# Altium schematic sheet Board CD.SchDoc
size A3
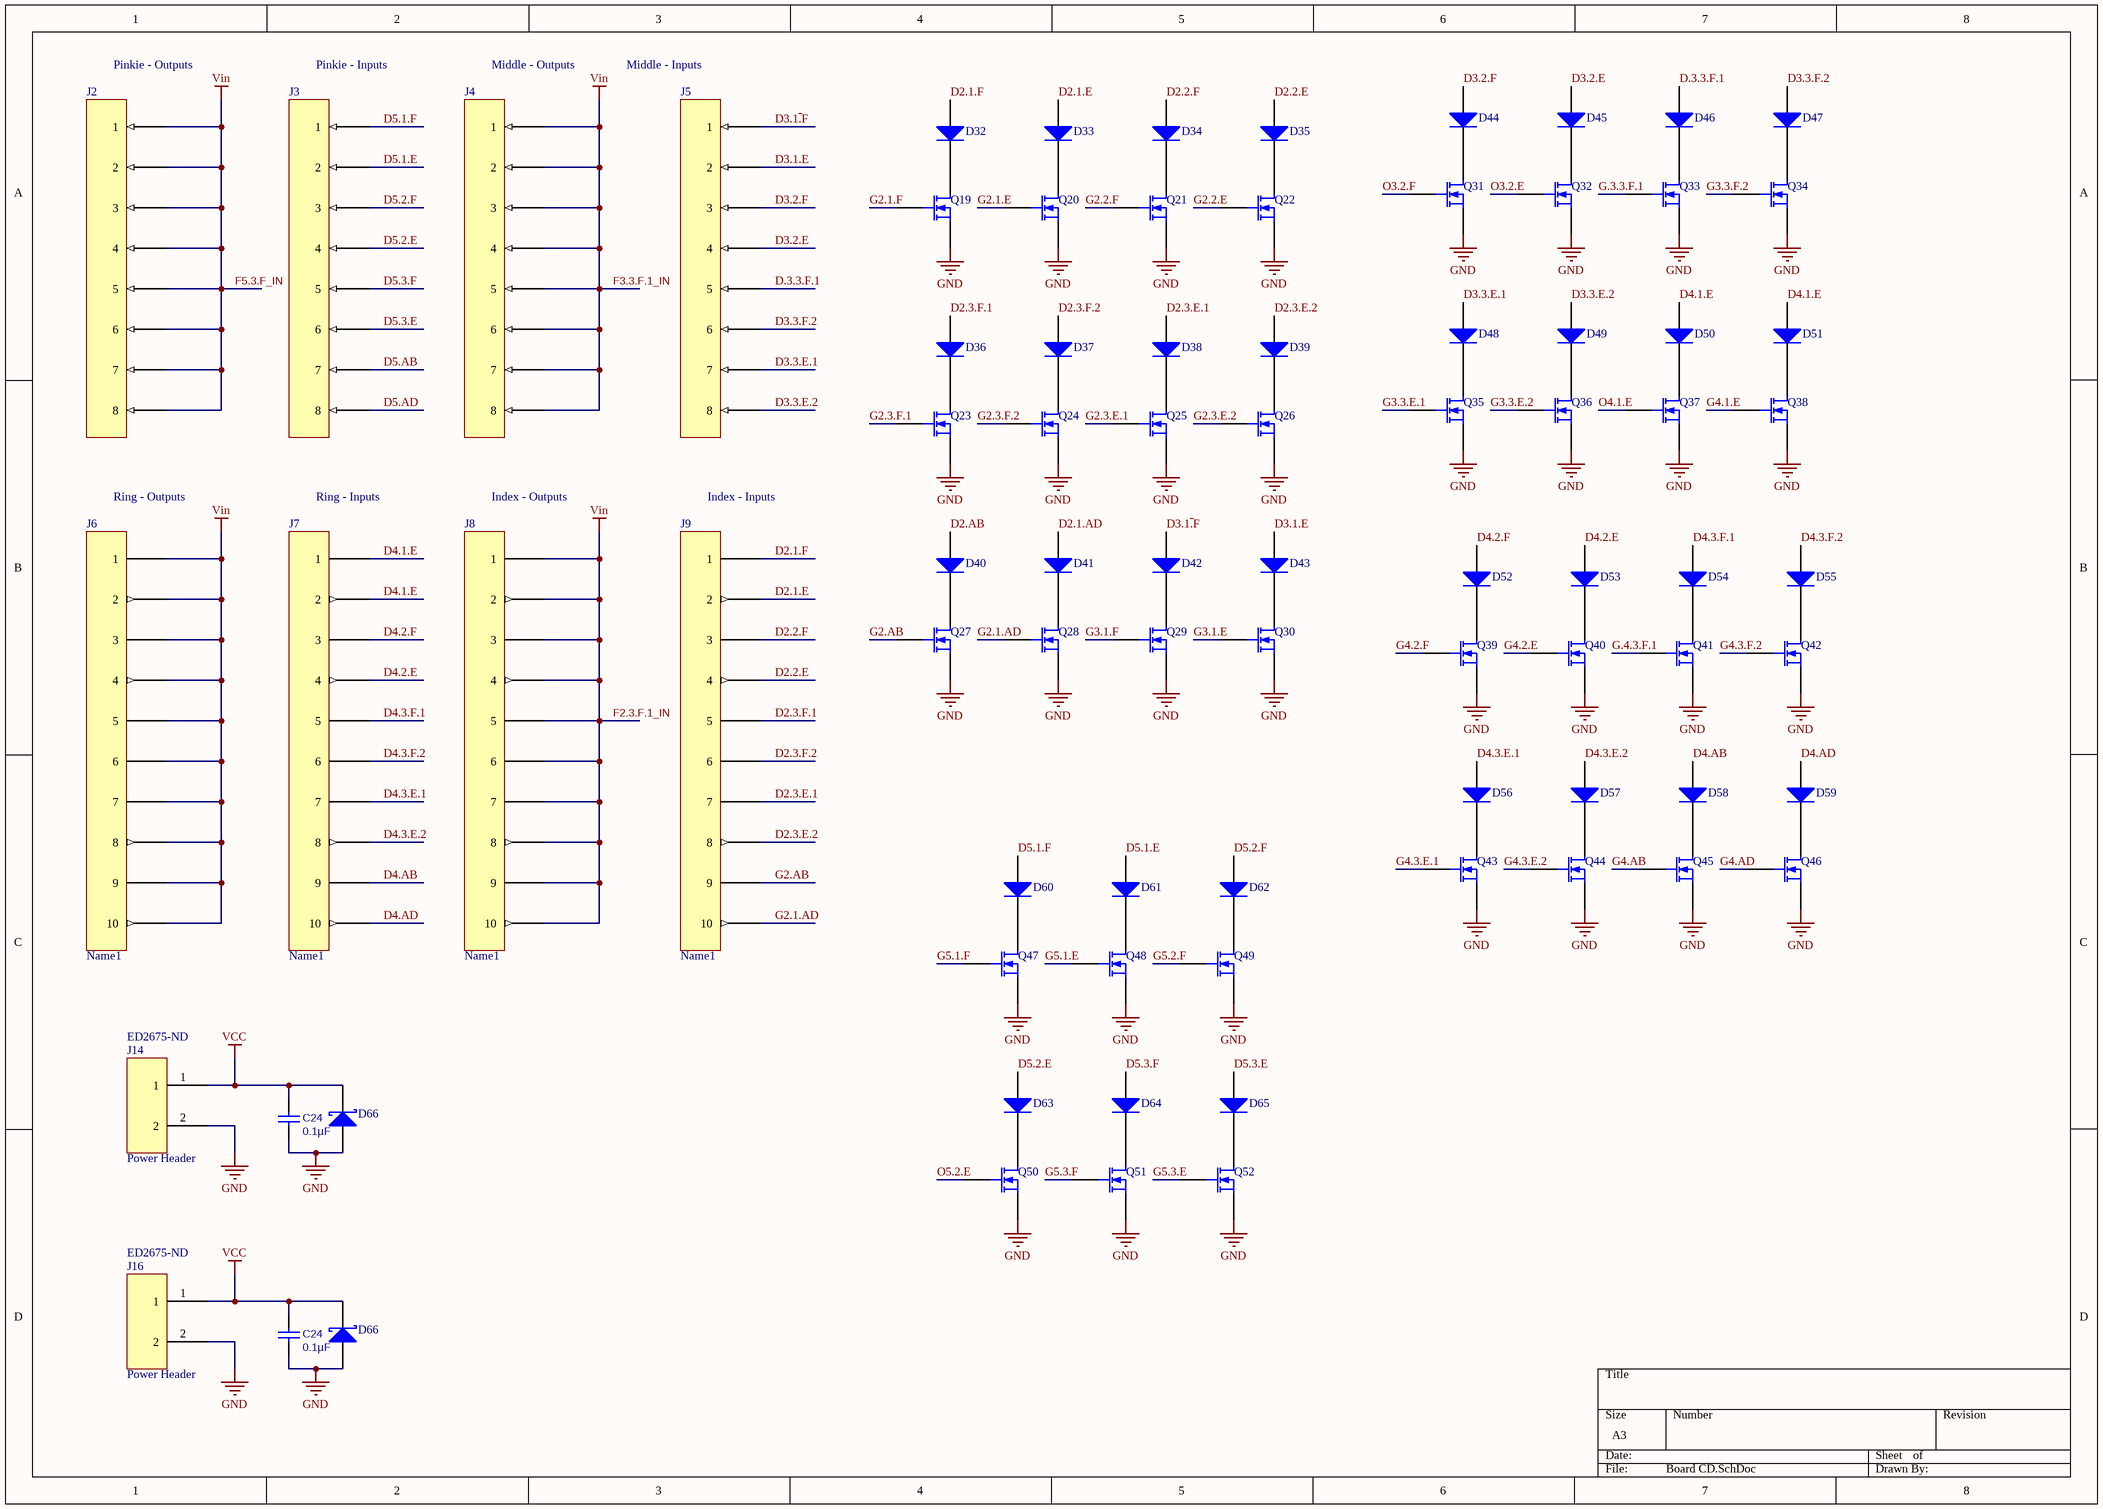
[diagram p0: Board CD.SchDoc]

## Parts
(Parts that share a designator on the sheet are numbered #1, #2 ... from top to bottom, then left to right.)
C24#1  value 0.1µF  [TDK C-Series (1608)]
C24#2  value 0.1µF  [TDK C-Series (1608)]
D32  de  [SMC]  (value not drawn)
D33  de  [SMC]  (value not drawn)
D34  de  [SMC]  (value not drawn)
D35  de  [SMC]  (value not drawn)
D36  de  [SMC]  (value not drawn)
D37  de  [SMC]  (value not drawn)
D38  de  [SMC]  (value not drawn)
D39  de  [SMC]  (value not drawn)
D40  de  [SMC]  (value not drawn)
D41  de  [SMC]  (value not drawn)
D42  de  [SMC]  (value not drawn)
D43  de  [SMC]  (value not drawn)
D44  de  [SMC]  (value not drawn)
D45  de  [SMC]  (value not drawn)
D46  de  [SMC]  (value not drawn)
D47  de  [SMC]  (value not drawn)
D48  de  [SMC]  (value not drawn)
D49  de  [SMC]  (value not drawn)
D50  de  [SMC]  (value not drawn)
D51  de  [SMC]  (value not drawn)
D52  de  [SMC]  (value not drawn)
D53  de  [SMC]  (value not drawn)
D54  de  [SMC]  (value not drawn)
D55  de  [SMC]  (value not drawn)
D56  de  [SMC]  (value not drawn)
D57  de  [SMC]  (value not drawn)
D58  de  [SMC]  (value not drawn)
D59  de  [SMC]  (value not drawn)
D60  de  [SMC]  (value not drawn)
D61  de  [SMC]  (value not drawn)
D62  de  [SMC]  (value not drawn)
D63  de  [SMC]  (value not drawn)
D64  de  [SMC]  (value not drawn)
D65  de  [SMC]  (value not drawn)
D66#1  Diode BAT17  [SOT-23_N]  (value not drawn)
D66#2  Diode BAT17  [SOT-23_N]  (value not drawn)
J2  3-794630-8  (value not drawn)
J3  3-794630-8  (value not drawn)
J4  3-794630-8  (value not drawn)
J5  3-794630-8  (value not drawn)
J6  Name1
J7  Name1
J8  Name1
J9  Name1
J14  Power Header  Supplier Part Number 1: ED2675-ND
J16  Power Header  Supplier Part Number 1: ED2675-ND
Q19  (no value)
Q20  (no value)
Q21  (no value)
Q22  (no value)
Q23  (no value)
Q24  (no value)
Q25  (no value)
Q26  (no value)
Q27  (no value)
Q28  (no value)
Q29  (no value)
Q30  (no value)
Q31  (no value)
Q32  (no value)
Q33  (no value)
Q34  (no value)
Q35  (no value)
Q36  (no value)
Q37  (no value)
Q38  (no value)
Q39  (no value)
Q40  (no value)
Q41  (no value)
Q42  (no value)
Q43  (no value)
Q44  (no value)
Q45  (no value)
Q46  (no value)
Q47  (no value)
Q48  (no value)
Q49  (no value)
Q50  (no value)
Q51  (no value)
Q52  (no value)

## Nets
F2.3.F.1_IN: J2.1 J2.3 J2.4 J2.5 J2.6 J2.7 J2.8 J2.66(2) J4.1 J4.3 J4.4 J4.5 J4.6 J4.7 J4.8 J4.66(2) J6.1 J6.3 J6.4 J6.5 J6.6 J6.7 J6.8 J6.9 J6.10 J6.66(2) J8.1 J8.3 J8.4 J8.5 J8.6 J8.7 J8.8 J8.9 J8.10 J8.66(2)  [also labelled F3.3.F.1_IN, F5.3.F_IN, Vin]
GND: C24#1.1 C24#2.1 D66#1.1(A) D66#2.1(A) J14.2 J16.2 Q19.3(S) Q20.3(S) Q21.3(S) Q22.3(S) Q23.3(S) Q24.3(S) Q25.3(S) Q26.3(S) Q27.3(S) Q28.3(S) Q29.3(S) Q30.3(S) Q31.3(S) Q32.3(S) Q33.3(S) Q34.3(S) Q35.3(S) Q36.3(S) Q37.3(S) Q38.3(S) Q39.3(S) Q40.3(S) Q41.3(S) Q42.3(S) Q43.3(S) Q44.3(S) Q45.3(S) Q46.3(S) Q47.3(S) Q48.3(S) Q49.3(S) Q50.3(S) Q51.3(S) Q52.3(S)
VCC: C24#1.2 C24#2.2 D66#1.3(K) D66#2.3(K) J14.1 J16.1
D2.1.AD: D41.1(A)
D2.1.E: D33.1(A) J9.66(2)
D2.1.F: D32.1(A) J9.1
D2.2.E: D35.1(A) J9.4
D2.2.F: D34.1(A) J9.3
D2.3.E.1: D38.1(A) J9.7
D2.3.E.2: D39.1(A) J9.8
D2.3.F.1: D36.1(A) J9.5
D2.3.F.2: D37.1(A) J9.6
D2.AB: D40.1(A)
D3.1~{.}F: D42.1(A) J5.1
D3.1.E: D43.1(A) J5.66(2)
D3.2.E: D45.1(A) J5.4
D3.2.F: D44.1(A) J5.3
D3.3.E.1: D48.1(A) J5.7
D3.3.E.2: D49.1(A) J5.8
D3.3.F.2: D47.1(A) J5.6
D4.1.E: D50.1(A) D51.1(A) J7.1 J7.66(2)
D4.2.E: D53.1(A) J7.4
D4.2.F: D52.1(A) J7.3
D4.3.E.1: D56.1(A) J7.7
D4.3.E.2: D57.1(A) J7.8
D4.3.F.1: D54.1(A) J7.5
D4.3.F.2: D55.1(A) J7.6
D4.AB: D58.1(A) J7.9
D4.AD: D59.1(A) J7.10
D5.1.E: D61.1(A) J3.66(2)
D5.1.F: D60.1(A) J3.1
D5.2.E: D63.1(A) J3.4
D5.2.F: D62.1(A) J3.3
D5.3.E: D65.1(A) J3.6
D5.3.F: D64.1(A) J3.5
D5.AB: J3.7
D5.AD: J3.8
D.3.3.F.1: D46.1(A) J5.5
G2.1.AD: J9.10 Q28.2(G)
G2.1.E: Q20.2(G)
G2.1.F: Q19.2(G)
G2.2.E: Q22.2(G)
G2.2.F: Q21.2(G)
G2.3.E.1: Q25.2(G)
G2.3.E.2: Q26.2(G)
G2.3.F.1: Q23.2(G)
G2.3.F.2: Q24.2(G)
G2.AB: J9.9 Q27.2(G)
G3.1.E: Q30.2(G)
G3.1.F: Q29.2(G)
G3.3.E.1: Q35.2(G)
G3.3.E.2: Q36.2(G)
G3.3.F.2: Q34.2(G)
G4.1.E: Q38.2(G)
G4.2.E: Q40.2(G)
G4.2.F: Q39.2(G)
G4.3.E.1: Q43.2(G)
G4.3.E.2: Q44.2(G)
G4.3.F.2: Q42.2(G)
G4.AB: Q45.2(G)
G4.AD: Q46.2(G)
G5.1.E: Q48.2(G)
G5.1.F: Q47.2(G)
G5.2.F: Q49.2(G)
G5.3.E: Q52.2(G)
G5.3.F: Q51.2(G)
G.3.3.F.1: Q33.2(G)
G.4.3.F.1: Q41.2(G)
O3.2.E: Q32.2(G)
O3.2.F: Q31.2(G)
O4.1.E: Q37.2(G)
O5.2.E: Q50.2(G)
NetD32_2: D32.2(K) Q19.1(D)
NetD33_2: D33.2(K) Q20.1(D)
NetD34_2: D34.2(K) Q21.1(D)
NetD35_2: D35.2(K) Q22.1(D)
NetD36_2: D36.2(K) Q23.1(D)
NetD37_2: D37.2(K) Q24.1(D)
NetD38_2: D38.2(K) Q25.1(D)
NetD39_2: D39.2(K) Q26.1(D)
NetD40_2: D40.2(K) Q27.1(D)
NetD41_2: D41.2(K) Q28.1(D)
NetD42_2: D42.2(K) Q29.1(D)
NetD43_2: D43.2(K) Q30.1(D)
NetD44_2: D44.2(K) Q31.1(D)
NetD45_2: D45.2(K) Q32.1(D)
NetD46_2: D46.2(K) Q33.1(D)
NetD47_2: D47.2(K) Q34.1(D)
NetD48_2: D48.2(K) Q35.1(D)
NetD49_2: D49.2(K) Q36.1(D)
NetD50_2: D50.2(K) Q37.1(D)
NetD51_2: D51.2(K) Q38.1(D)
NetD52_2: D52.2(K) Q39.1(D)
NetD53_2: D53.2(K) Q40.1(D)
NetD54_2: D54.2(K) Q41.1(D)
NetD55_2: D55.2(K) Q42.1(D)
NetD56_2: D56.2(K) Q43.1(D)
NetD57_2: D57.2(K) Q44.1(D)
NetD58_2: D58.2(K) Q45.1(D)
NetD59_2: D59.2(K) Q46.1(D)
NetD60_2: D60.2(K) Q47.1(D)
NetD61_2: D61.2(K) Q48.1(D)
NetD62_2: D62.2(K) Q49.1(D)
NetD63_2: D63.2(K) Q50.1(D)
NetD64_2: D64.2(K) Q51.1(D)
NetD65_2: D65.2(K) Q52.1(D)

## Notes on the sheet
- Pinkie - Outputs
- Pinkie - Inputs
- Middle - Outputs
- Middle - Inputs
- Ring - Outputs
- Ring - Inputs
- Index - Outputs
- Index - Inputs

## Library data of the parts
C24#1 C24#2 = Cap: Capacitor; Published: 8-Jun-2000; LatestRevisionDate: 17-Jul-2002; LatestRevisionNote: Re-released for DXP Platform.; PackageReference: RAD-0.3; Publisher: Altium Limited; PackageDescription: Radial Cap, Thru-Hole; 2 Leads; 0.3 in Pin Spacing; Supplier 1: Digi-Key; Supplier Part Number 1: 445-1316-1-ND
D32-D65 = Diode: Default Diode; Published: 8-Jun-2000; LatestRevisionDate: 17-Jul-2002; LatestRevisionNote: Re-released for DXP Platform.; PackageVersion: Sep-1996; PackageReference: SMC; Publisher: Altium Limited; PackageDescription: DO-214-AB/SMC; 2 C-Bend Leads; Body 7.9 x 5.9 mm, inc. leads (LxW); Code_JEDEC: DO-214-AB; Supplier 1: Digi-Key; Supplier Part Number 1: 1727-5384-1-ND
D66#1 D66#2 = Diode BAT17: Silicon RF Schottky Diode for Mixer Applications in the VHF/UHF Range; Note: Pin 2 is not connected and not drawn.; Published: 21-Mar-2003; LatestRevisionDate: 29-May-2009; LatestRevisionNote: IPC-7351 Footprint Added.; DatasheetVersion: Oct-1999; PackageVersion: Sep-2001; PackageReference: SOT-23; Publisher: Altium Limited; PackageDescription: 3-Pin SOT-23 Package 0.95 mm Pitch, 2.5 mm Lead Span; ComponentLink1Description: Manufacturer Link; ComponentLink1URL: http://www.infineon.com/; ComponentLink2Description: Datasheet; ComponentLink2URL: http://www.infineon.com/upload/Document/cmc_upload/documents/009/363/bat17series.pdf; Supplier 1: Digi-Key; Supplier Part Number 1: DF2S10FSL3MCT-ND
J2-J5 = 3-794630-8: 8 Position Header; Supplier 1: Digi-Key; Supplier Part Number 1: A33222-ND
J6-J9 = Name1: 10 position header
Q19-Q52 = MOSFET-N: N-Channel MOSFET; Published: 8-Jun-2000; LatestRevisionDate: 17-Jul-2002; LatestRevisionNote: Re-released for DXP Platform.; PackageVersion: 1995/1996; PackageReference: E3; Publisher: Altium Limited; PackageDescription: TO, Flat Index; 3 In-Line, Axial Leads; Body Dia. 4.6mm; Lead Dia. 0.5 mm (max); Supplier 1: Digi-Key; Supplier 2: Digi-Key; Supplier Part Number 2: 497-7462-1-ND
J14 J16 = Power Header: Supplier 1: Digi-Key